# EAGLE design power-bridge (EAGLE 9.7.0)
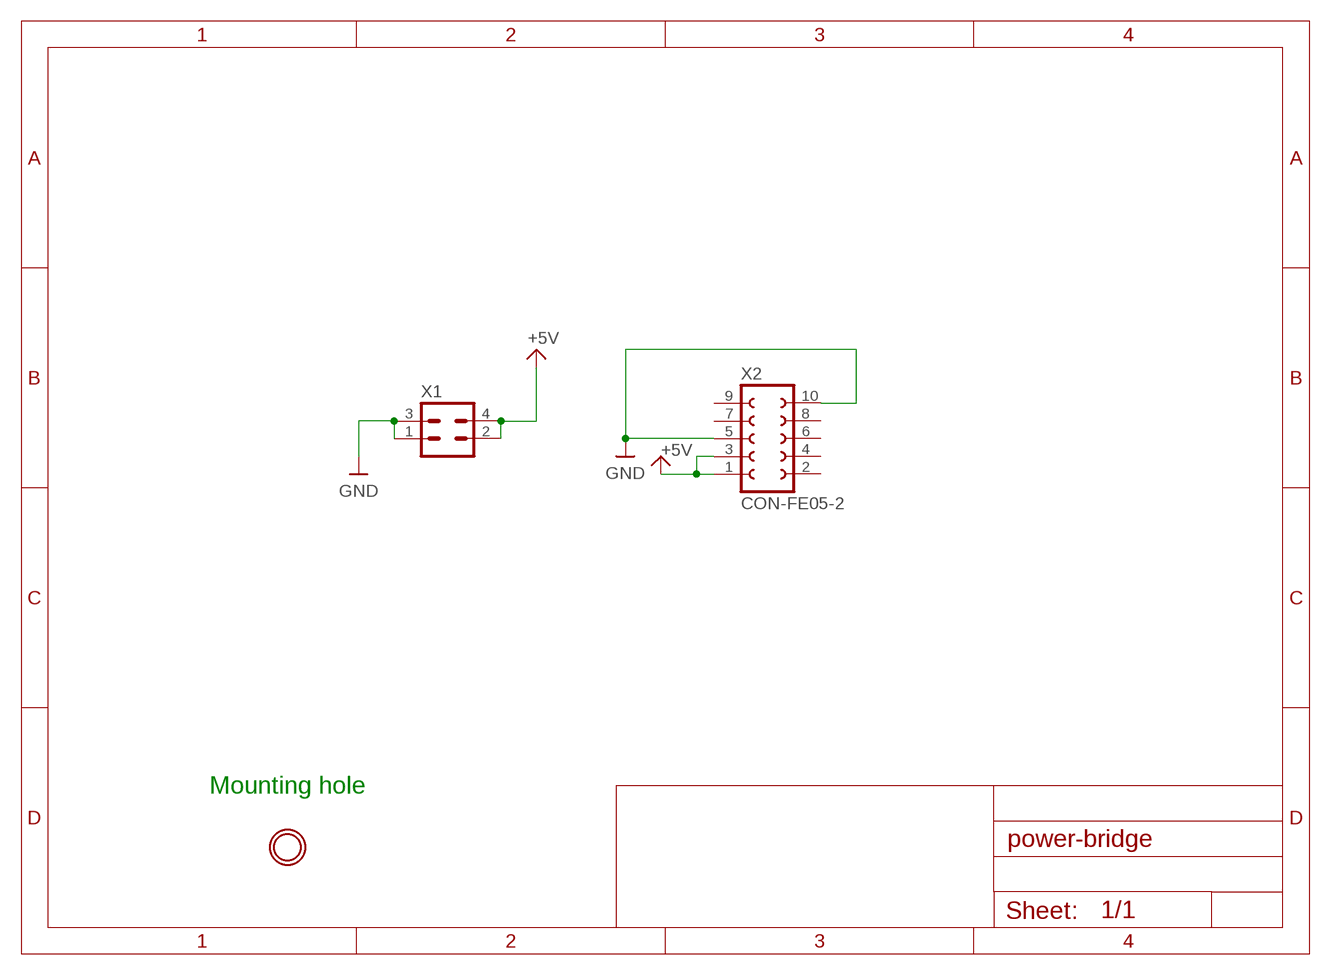
[diagram p0: schematic, sheet 1]

## Parts
U$1  MOUNTINGHOLE2.7_THICK  [MOUNTINGHOLE_2.7_PLATED_THICK]
X1  CON-MA02-2  [HDRRA4W64P254_2X2_508X254X556B]
X2  CON-FE05-2  [HDRVR10W64P254_2X5_1270X508X850B]

## Nets
+5V: X1.2 X1.4 X2.1 X2.3 ; supply symbol labelled +5
GND: X1.1 X1.3 X2.5 X2.10
Unconnected: X2.2 X2.4 X2.6 X2.7 X2.8 X2.9

## Notes on the sheet
- Mounting hole

## Library data of the parts
U$1 = _Library.b1f76137-4d0f-4ce2-9703-0cd83550450f.flbr:MOUNTINGHOLE: Mounting Hole For #2 screws (0.086"/2.18mm width, 0.094"/2.4mm hole) use 2.5mm; BOM: EXCLUDE
X1 = _Library.b1f76137-4d0f-4ce2-9703-0cd83550450f.flbr:CON-MA02-2
X2 = _Library.b1f76137-4d0f-4ce2-9703-0cd83550450f.flbr:CON-FE05-2

## Board
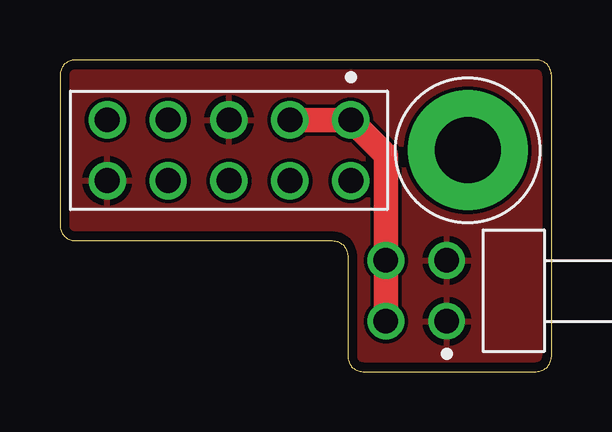
[diagram p1: board, top side]
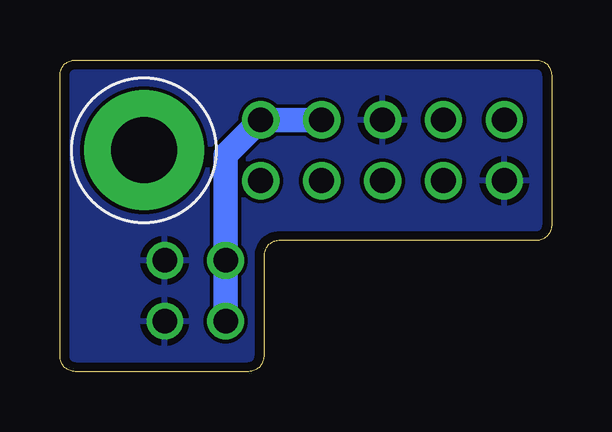
[diagram p2: board, bottom side, seen from below]

Size 20.5 x 13 mm. Coordinates in mm from the lower left corner, seen from the top.
Outline: 12.63,0 19.86,0 arc90 20.5,0.64 20.5,12.37 arc90 19.86,13 0.64,13 arc90 0,12.37 0,6.09 arc90 0.64,5.46 11.37,5.46 arc-90 12,4.83 12,0.64 arc90 12.63,0
Copper layers (1*16): Top 0.035559375mm / dielectric 1.6mm / Bottom 0.035559375mm
Design rules "oshpark-2layer": minimum track width 6mil, minimum drill 10mil, track to track 6mil, track to pad 6mil, pad to pad 6mil, via to via 6mil, smd to smd 6mil, copper to edge 15mil, drill to drill 6mil, minimum pad ring 5mil, minimum via ring 5mil, stop-mask expansion 2.5mil, vias tented up to drill 0mil, thermal gap 10mil

### Footprints (pad centres in the part's own frame; a part is rotated, then mirrored left to right if it is on the bottom)
MOUNTINGHOLE_2.7_PLATED_THICK = drill 2.75 pad 5: P$1 0,0
HDRRA4W64P254_2X2_508X254X556B = drill 1.02: 1 0,0; 2 0,2.54; 3 2.54,0; 4 2.54,2.54
HDRVR10W64P254_2X5_1270X508X850B = drill 1.04: 1 0,0; 2 0,2.54; 3 2.54,0; 4 2.54,2.54; 5 5.08,0; 6 5.08,2.54; 7 7.62,0; 8 7.62,2.54; 9 10.16,0; 10 10.16,2.54

### Placement (x,y rotation side)
U$1  17,9.23 0 top
X1  16.13,2.1 90 top
X2  12.13,10.5 180 top

### Tracks (layer width: path | path; a pad name or v marks a point on that pad's centre or on a via)
+5V
  Top 1.016: X1.2 X1.4 13.59,9.04 X2.1 X2.3
  Bottom 1.016: X1.2 X1.4 13.59,9.04 X2.1 X2.3
GND
  pour Bottom: -1,-1 22,-1 22,13.5 -1,13.5
  pour Top: -1,-1 22,-1 22,13.5 -1,13.5